# EAGLE design SignBuddy Main Board Schematic (EAGLE 9.6.2)

## Sheet 1 of 3: STM32L0538
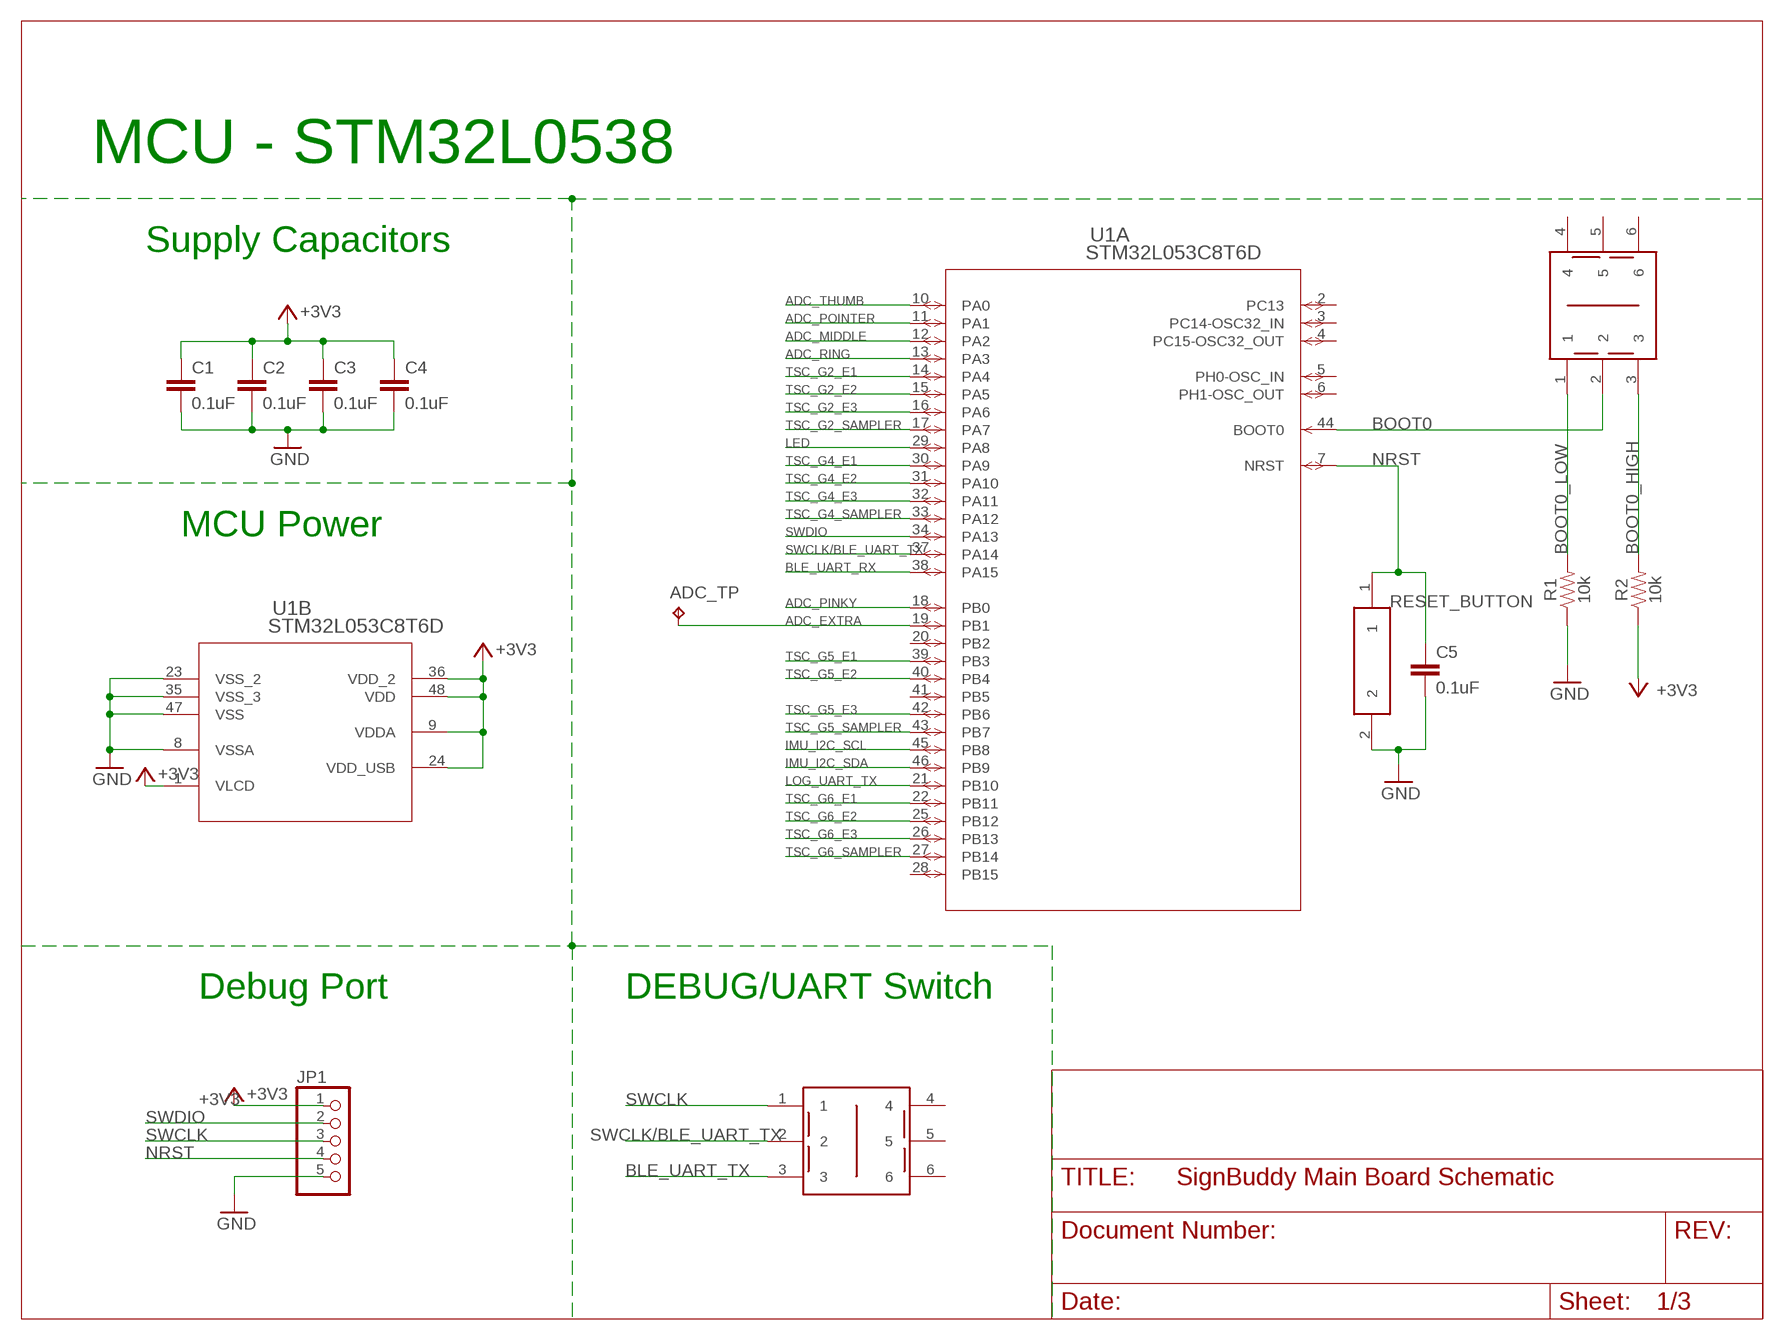
[diagram p0: schematic, sheet 1]

### Parts
ADC_TP  TPB1,27  [B1,27]
C1  0.1uF  10UF-0603-6.3V-20%  [0603]
C2  0.1uF  10UF-0603-6.3V-20%  [0603]
C3  0.1uF  10UF-0603-6.3V-20%  [0603]
C4  0.1uF  10UF-0603-6.3V-20%  [0603]
C5  0.1uF  10UF-0603-6.3V-20%  [0603]
JP1  PINHD-1X5  [1X05]
R1  10k  1.8KOHM-0603-1/10W-1%  [0603]
R2  10k  1.8KOHM-0603-1/10W-1%  [0603]
RESET_BUTTON  PUSH_BUTTON  [PUSH_BUTTON]
U1  STM32L053C8T6D  [LQFP48-7X7MM]
U$1  SLIDE_SWITCH  [SLIDE_SWITCH]
U$2  SLIDE_SWITCH  [SLIDE_SWITCH]

### Nets
+3V3: C1.1 C2.1 C3.1 C4.1 JP1.1 R2.1 U1.1(B:VLCD) U1.9(B:VDDA) U1.24(B:VDD_USB) U1.36(B:VDD_2) U1.48(B:VDD) ; also sheet 2,3
ADC_EXTRA: ADC_TP.TP U1.19(A:PB1)
ADC_MIDDLE: U1.12(A:PA2) ; also sheet 3
ADC_PINKY: U1.18(A:PB0) ; also sheet 3
ADC_POINTER: U1.11(A:PA1) ; also sheet 3
ADC_RING: U1.13(A:PA3) ; also sheet 3
ADC_THUMB: U1.10(A:PA0) ; also sheet 3
BLE_UART_RX: U1.38(A:PA15) ; also sheet 3
BLE_UART_TX: U$2.3 ; also sheet 3
BOOT0: U1.44(A:BOOT0) U$1.2
BOOT0_HIGH: R2.2 U$1.3
BOOT0_LOW: R1.2 U$1.1
GND: C1.2 C2.2 C3.2 C4.2 C5.2 JP1.5 R1.1 RESET_BUTTON.2 U1.8(B:VSSA) U1.23(B:VSS_2) U1.35(B:VSS_3) U1.47(B:VSS) ; also sheet 2,3
IMU_I2C_SCL: U1.45(A:PB8) ; also sheet 3
IMU_I2C_SDA: U1.46(A:PB9) ; also sheet 3
LED: U1.29(A:PA8) ; also sheet 2
LOG_UART_TX: U1.21(A:PB10) ; also sheet 2
NRST: C5.1 JP1.4 RESET_BUTTON.1 U1.7(A:NRST)
SWCLK: JP1.3 U$2.1
SWCLK/BLE_UART_TX: U1.37(A:PA14) U$2.2
SWDIO: JP1.2 U1.34(A:PA13)
TSC_G2_E1: U1.14(A:PA4) ; also sheet 3
TSC_G2_E2: U1.15(A:PA5) ; also sheet 3
TSC_G2_E3: U1.16(A:PA6) ; also sheet 3
TSC_G2_SAMPLER: U1.17(A:PA7) ; also sheet 3
TSC_G4_E1: U1.30(A:PA9) ; also sheet 3
TSC_G4_E2: U1.31(A:PA10) ; also sheet 3
TSC_G4_E3: U1.32(A:PA11) ; also sheet 3
TSC_G4_SAMPLER: U1.33(A:PA12) ; also sheet 3
TSC_G5_E1: U1.39(A:PB3) ; also sheet 3
TSC_G5_E2: U1.40(A:PB4) ; also sheet 3
TSC_G5_E3: U1.42(A:PB6) ; also sheet 3
TSC_G5_SAMPLER: U1.43(A:PB7) ; also sheet 3
TSC_G6_E1: U1.22(A:PB11) ; also sheet 3
TSC_G6_E2: U1.25(A:PB12) ; also sheet 3
TSC_G6_E3: U1.26(A:PB13) ; also sheet 3
TSC_G6_SAMPLER: U1.27(A:PB14) ; also sheet 3
Unconnected: U1.2(A:PC13) U1.3(A:PC14-OSC32_IN) U1.4(A:PC15-OSC32_OUT) U1.5(A:PH0-OSC_IN) U1.6(A:PH1-OSC_OUT) U1.20(A:PB2) U1.28(A:PB15) U1.41(A:PB5) U$1.4 U$1.5 U$1.6 U$2.4 U$2.5 U$2.6

### Notes on the sheet
- MCU - STM32L0538
- Supply Capacitors
- MCU Power
- Debug Port | DEBUG/UART Switch

## Sheet 2 of 3: POWER
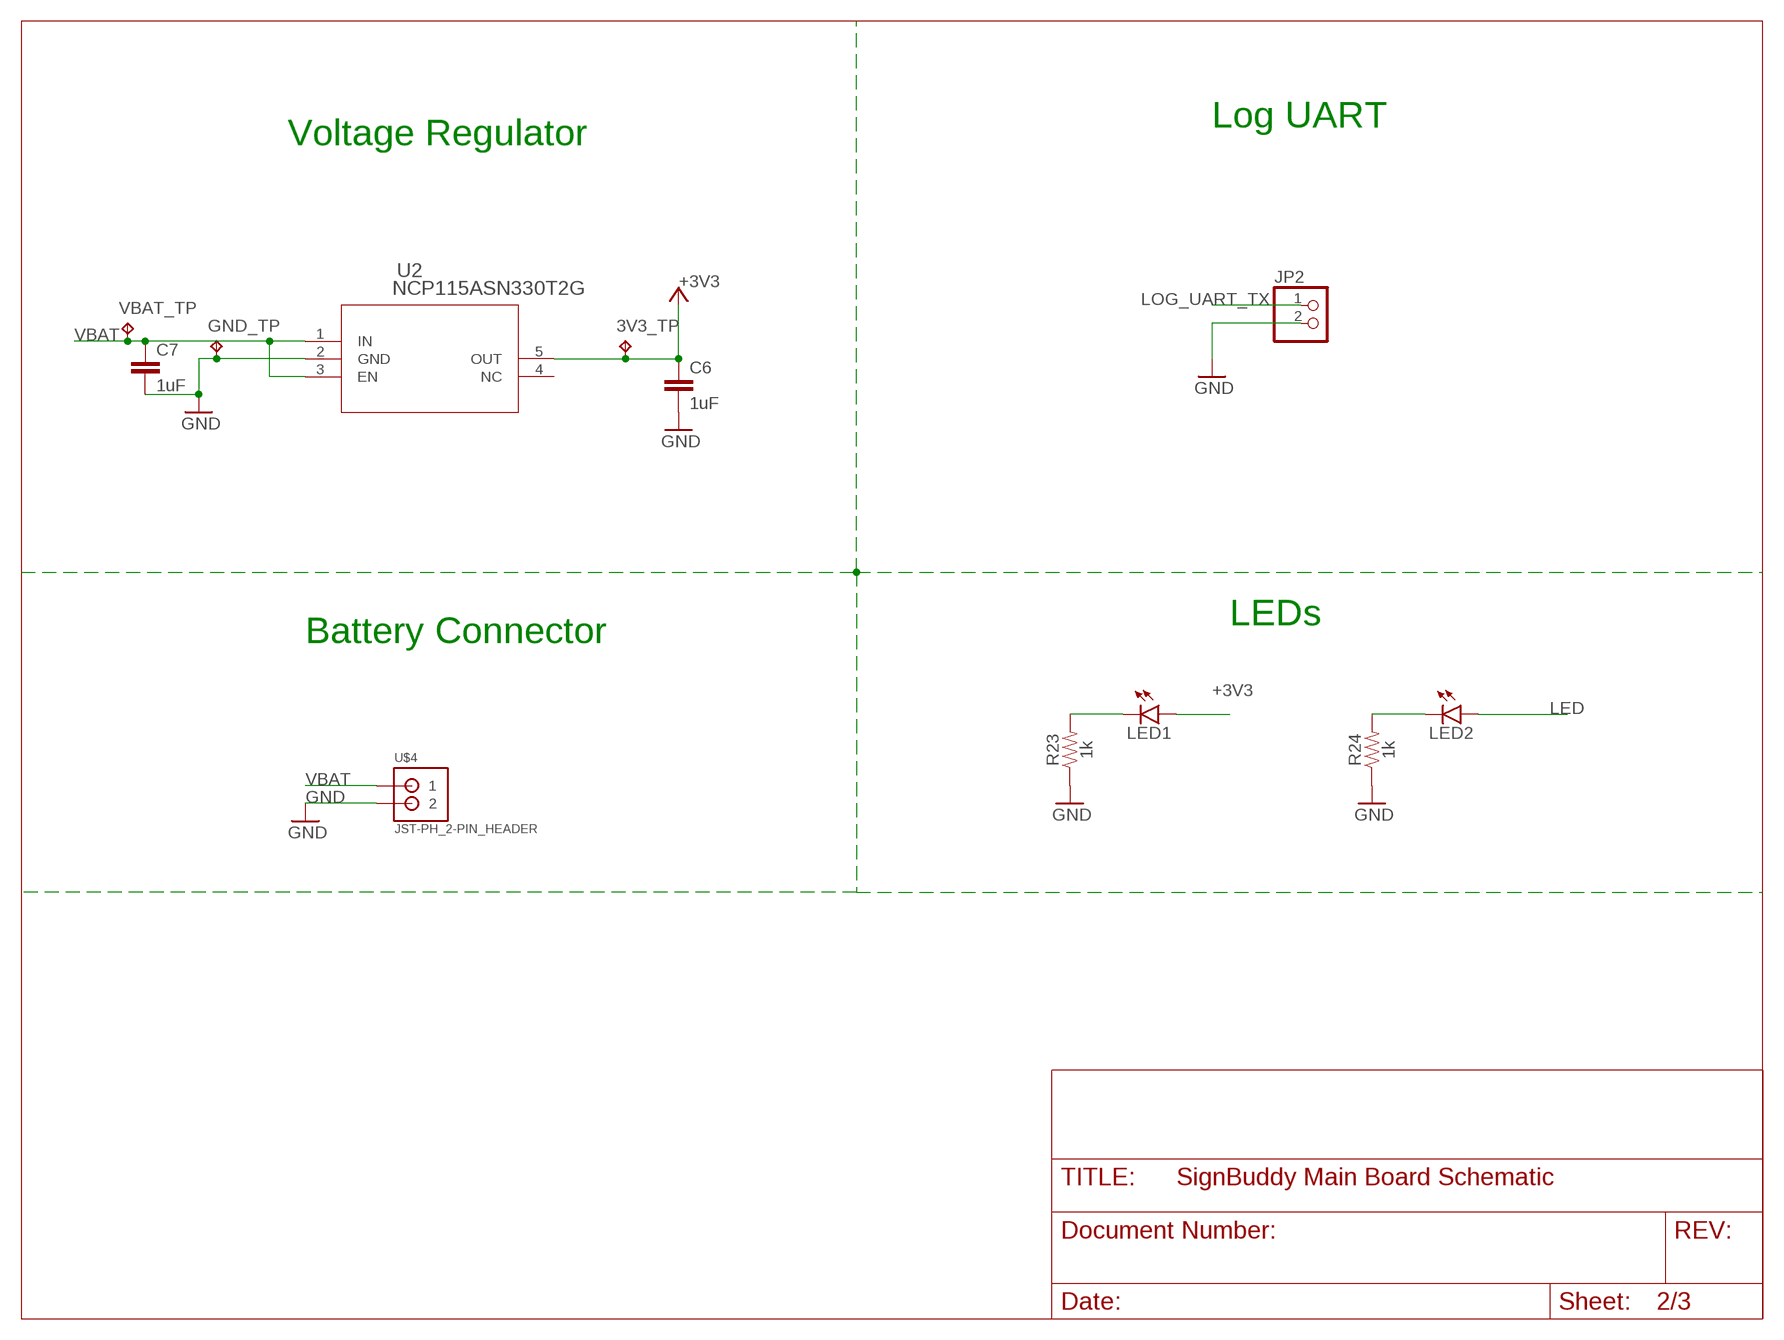
[diagram p1: schematic, sheet 2]

### Parts
3V3_TP  TPB1,27  [B1,27]
C6  1uF  10UF-0603-6.3V-20%  [0603]
C7  1uF  10UF-0603-6.3V-20%  [0603]
GND_TP  TPB1,27  [B1,27]
JP2  PINHD-1X2  [1X02]
LED1  LEDCHIP-LED0603  [CHIP-LED0603]
LED2  LEDCHIP-LED0603  [CHIP-LED0603]
R23  1k  1.5KOHM-0603-1/10W-1%  [0603]
R24  1k  1.5KOHM-0603-1/10W-1%  [0603]
U2  NCP115ASN330T2G  [TSOP-5-483-N_ONS]
U$4  JST-PH_2-PIN_HEADER  [JST_B2B-PH_HEADER]
VBAT_TP  TPB1,27  [B1,27]

### Nets
+3V3: 3V3_TP.TP C6.1 LED1.A U2.5(OUT) ; also sheet 1,3
GND: C6.2 C7.2 GND_TP.TP JP2.2 R23.1 R24.1 U2.2(GND) U$4.P2 ; also sheet 1,3
LED: LED2.A ; also sheet 1
LOG_UART_TX: JP2.1 ; also sheet 1
N$3: LED2.C R24.2
N$17: LED1.C R23.2
VBAT: C7.1 U2.1(IN) U2.3(EN) U$4.P1 VBAT_TP.TP
Unconnected: U2.4(NC)

### Notes on the sheet
- Log UART
- Voltage Regulator
- LEDs
- Battery Connector

## Sheet 3 of 3: External Modules
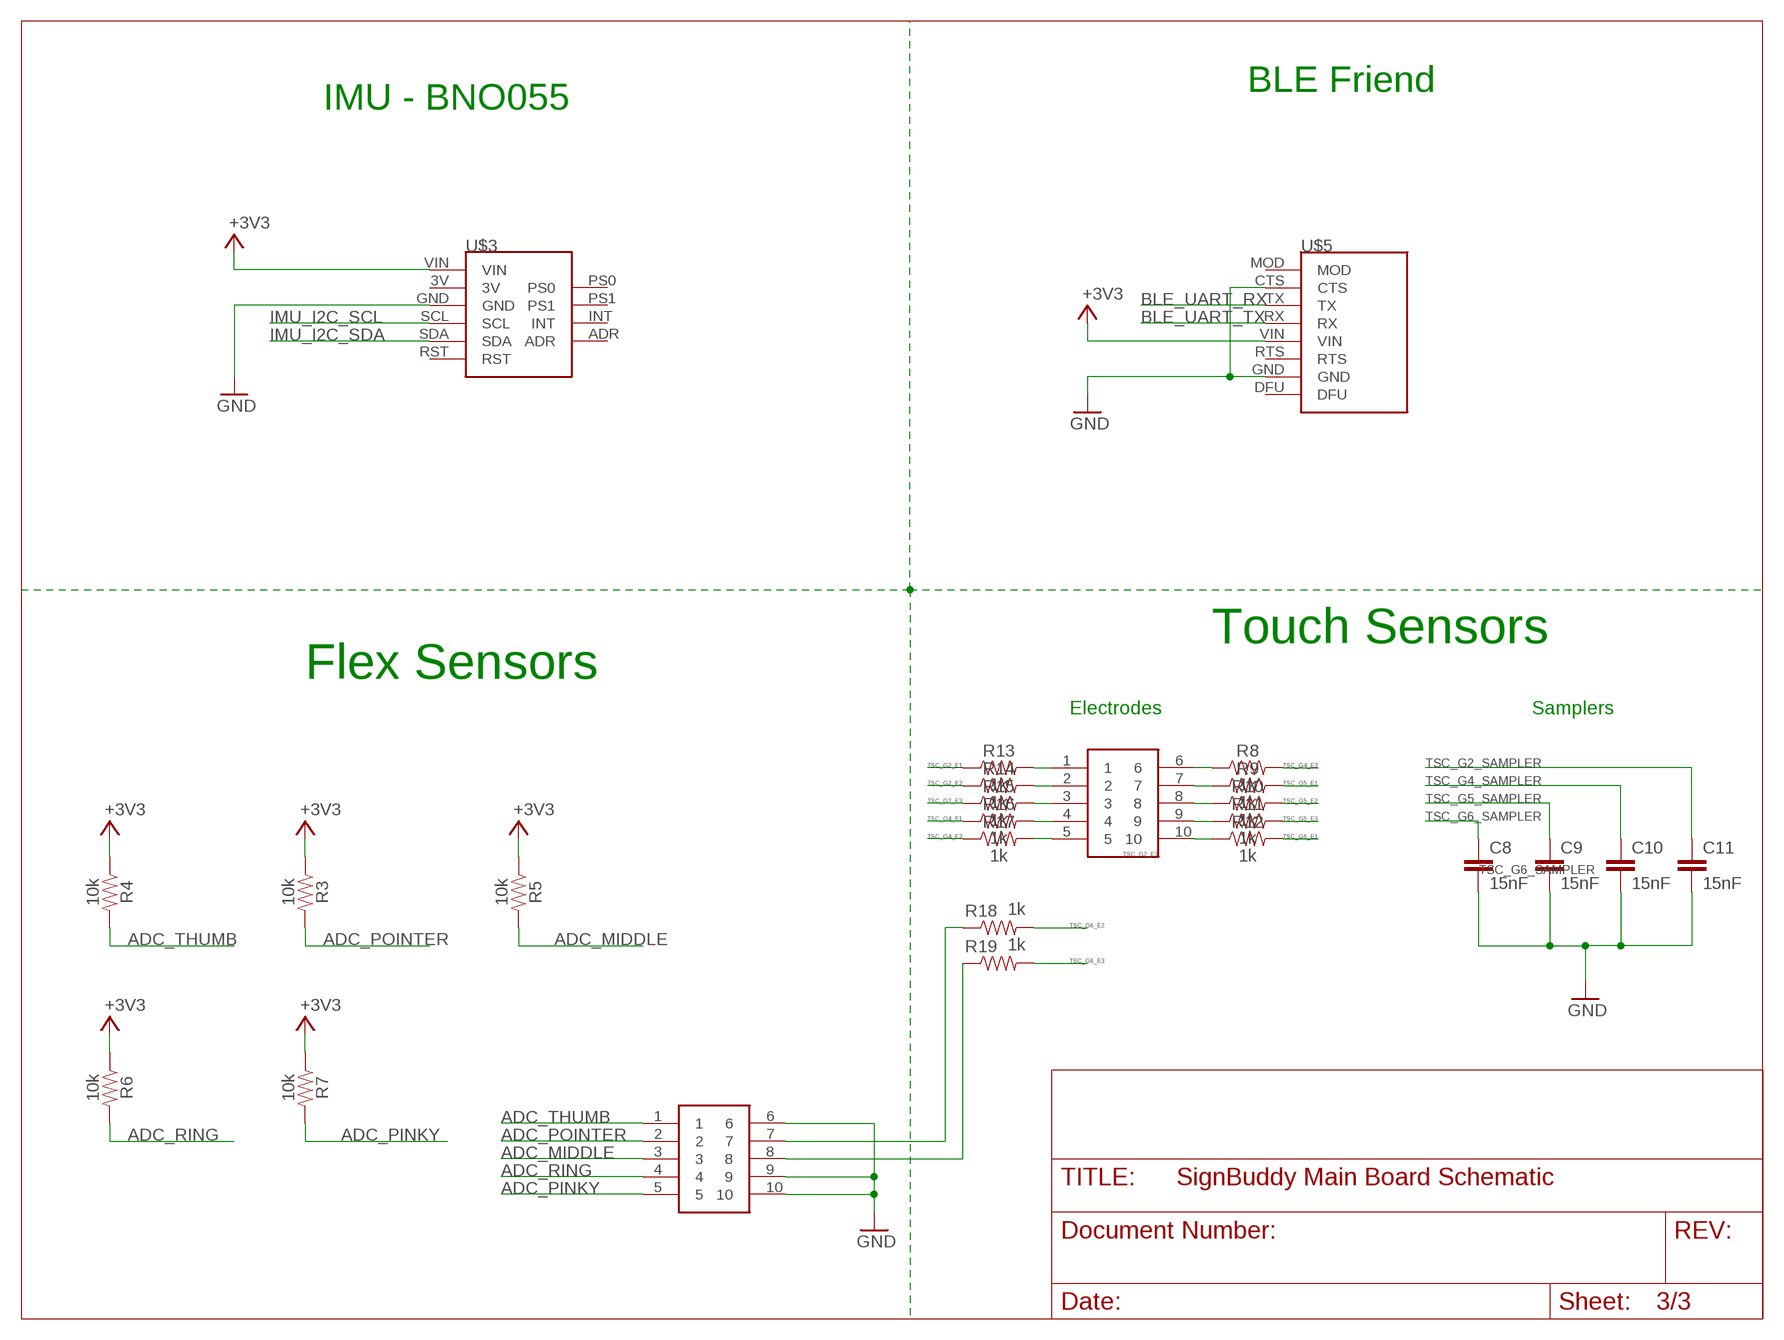
[diagram p2: schematic, sheet 3]

### Parts
C8  15nF  10UF-0603-6.3V-20%  [0603]
C9  15nF  10UF-0603-6.3V-20%  [0603]
C10  15nF  10UF-0603-6.3V-20%  [0603]
C11  15nF  10UF-0603-6.3V-20%  [0603]
R3  10k  10KOHM-0603-1/10W-1%  [0603]
R4  10k  10KOHM-0603-1/10W-1%  [0603]
R5  10k  10KOHM-0603-1/10W-1%  [0603]
R6  10k  10KOHM-0603-1/10W-1%  [0603]
R7  10k  10KOHM-0603-1/10W-1%  [0603]
R8  1k  10KOHM-0603-1/10W-1%  [0603]
R9  1k  10KOHM-0603-1/10W-1%  [0603]
R10  1k  10KOHM-0603-1/10W-1%  [0603]
R11  1k  10KOHM-0603-1/10W-1%  [0603]
R12  1k  10KOHM-0603-1/10W-1%  [0603]
R13  1k  10KOHM-0603-1/10W-1%  [0603]
R14  1k  10KOHM-0603-1/10W-1%  [0603]
R15  1k  10KOHM-0603-1/10W-1%  [0603]
R16  1k  10KOHM-0603-1/10W-1%  [0603]
R17  1k  10KOHM-0603-1/10W-1%  [0603]
R18  1k  10KOHM-0603-1/10W-1%  [0603]
R19  1k  10KOHM-0603-1/10W-1%  [0603]
U$3  BNO055-ADAFRUIT  [BNO055-ADAFRUIT]
U$5  BLE_FRIEND  [BLE_FRIEND]
U$6  10PIN_CONNECTOR  [10PIN_CONNECTOR]
U$7  10PIN_CONNECTOR  [10PIN_CONNECTOR]

### Nets
+3V3: R3.1 R4.1 R5.1 R6.1 R7.1 U$3.VIN U$5.VIN ; also sheet 1,2
ADC_MIDDLE: R5.2 U$7.3 ; also sheet 1
ADC_PINKY: R7.2 U$7.5 ; also sheet 1
ADC_POINTER: R3.2 U$7.2 ; also sheet 1
ADC_RING: R6.2 U$7.4 ; also sheet 1
ADC_THUMB: R4.2 U$7.1 ; also sheet 1
BLE_UART_RX: U$5.TX ; also sheet 1
BLE_UART_TX: U$5.RX ; also sheet 1
GND: C8.2 C9.2 C10.2 C11.2 U$3.GND U$5.CTS U$5.GND U$7.6 U$7.9 U$7.10 ; also sheet 1,2
IMU_I2C_SCL: U$3.SCL ; also sheet 1
IMU_I2C_SDA: U$3.SDA ; also sheet 1
N$5: R13.2 U$6.1
N$6: R18.1 U$7.7
N$7: R19.1 U$7.8
N$8: R14.2 U$6.2
N$9: R15.2 U$6.3
N$10: R16.2 U$6.4
N$11: R17.2 U$6.5
N$12: R8.1 U$6.6
N$13: R9.1 U$6.7
N$14: R10.1 U$6.8
N$15: R11.1 U$6.9
N$16: R12.1 U$6.10
TSC_G2_E1: R13.1 ; also sheet 1
TSC_G2_E2: R14.1 ; also sheet 1
TSC_G2_E3: R15.1 ; also sheet 1
TSC_G2_SAMPLER: C11.1 ; also sheet 1
TSC_G4_E1: R16.1 ; also sheet 1
TSC_G4_E2: R17.1 ; also sheet 1
TSC_G4_E3: R8.2 ; also sheet 1
TSC_G4_SAMPLER: C10.1 ; also sheet 1
TSC_G5_E1: R9.2 ; also sheet 1
TSC_G5_E2: R10.2 ; also sheet 1
TSC_G5_E3: R11.2 ; also sheet 1
TSC_G5_SAMPLER: C9.1 ; also sheet 1
TSC_G6_E1: R12.2 ; also sheet 1
TSC_G6_E2: R18.2 ; also sheet 1
TSC_G6_E3: R19.2 ; also sheet 1
TSC_G6_SAMPLER: C8.1 ; also sheet 1
Unconnected: U$3.3V U$3.ADR U$3.INT U$3.PS0 U$3.PS1 U$3.RST U$5.DFU U$5.MOD U$5.RTS

### Notes on the sheet
- BLE Friend
- IMU - BNO055
- Touch Sensors
- Flex Sensors
- Electrodes | Samplers

## Library data of the parts
3V3_TP ADC_TP GND_TP VBAT_TP = testpad:TP: Test pad
C1-C11 = SparkFun-Capacitors:10UF: 10.0µF ceramic capacitors A capacitor is a passive two-terminal electrical component used to store electrical energy temporarily in an electric field.; PROD_ID: CAP-11015; VALUE: 10uF
JP1 = pinhead:PINHD-1X5: PIN HEADER
JP2 = pinhead:PINHD-1X2: PIN HEADER
LED1 LED2 = led:LED: LED OSRAM: - CHIPLED LG R971, LG N971, LY N971, LG Q971, LY Q971, LO R971, LY R971 LH N974, LH R974 LS Q976, LO Q976, LY Q976 LO Q996 - Hyper CHIPLED LW Q18S LB Q993, LB Q99A, LB R99A - SideLED LS A670, LO A670, LY A670, LG A670, LP A670 LB A673, LV A673, LT A673, LW A673 LH A674 LY A675 LS A676, LA A676, LO A676, LY A676, LW A676 LS A679, LY A679, LG A679 - Hyper Micro SIDELED® LS Y876, LA Y876, LO Y876, LY Y876 LT Y87S - SmartLED LW L88C, LW L88S LB L89C, LB L89S, LG L890 LS L89K, LO L89K, LY L89K LS L896, LA L896, LO L896, LY L896 - TOPLED LS T670, LO T670, LY T670, LG T670, LP T670 LSG T670, LSP T670, LSY T670, LOP T670, LYG T670 LG T671, LOG T671, LSG T671 LB T673, LV T673, LT T673, LW T673 LH T674 LS T676, LA T676, LO T676, LY T676, LB T676, LH T676, LSB T676, LW T676 LB T67C, LV T67C, LT T67C, LS T67K, LO T67K, LY T67K, LW E67C LS E67B, LA E67B, LO E67B, LY E67B, LB E67C, LV E67C, LT E67C LW T67C LS T679, LY T679, LG T679 LS T770, LO T770, LY T770, LG T770, LP T770 LB T773, LV T773, LT T773, LW T773 LH T774 LS E675, LA E675, LY E675, LS T675 LS T776, LA T776, LO T776, LY T776, LB T776 LHGB T686 LT T68C, LB T68C - Hyper Mini TOPLED® LB M676 - Mini TOPLED Santana® LG M470 LS M47K, LO M47K, LY M47K Source: http://www.osram.convergy.de LUXEON: - LUMILED® LXK2-PW12-R00, LXK2-PW12-S00, LXK2-PW14-U00, LXK2-PW14-V00 LXK2-PM12-R00, LXK2-PM12-S00, LXK2-PM14-U00 LXK2-PE12-Q00, LXK2-PE12-R00, LXK2-PE12-S00, LXK2-PE14-T00, LXK2-PE14-U00 LXK2-PB12-K00, LXK2-PB12-L00, LXK2-PB12-M00, LXK2-PB14-N00, LXK2-PB14-P00, LXK2-PB14-Q00 LXK2-PR12-L00, LXK2-PR12-M00, LXK2-PR14-Q00, LXK2-PR14-R00 LXK2-PD12-Q00, LXK2-PD12-R00, LXK2-PD12-S00 LXK2-PH12-R00, LXK2-PH12-S00 LXK2-PL12-P00, LXK2-PL12-Q00, LXK2-PL12-R00 Source: www.luxeon.com KINGBRIGHT: KA-3528ASYC Source: www.kingbright.com
R1 R2 = SparkFun-Resistors:1.8KOHM: 1.8kΩ resistor A resistor is a passive two-terminal electrical component that implements electrical resistance as a circuit element. Resistors act to reduce current flow, and, at the same time, act to lower voltage levels within circuits. - Wikipedia; PROD_ID: RES-09119; VALUE: 1.8k
R3-R7 = SparkFun-Resistors:10KOHM: 10kΩ resistor A resistor is a passive two-terminal electrical component that implements electrical resistance as a circuit element. Resistors act to reduce current flow, and, at the same time, act to lower voltage levels within circuits. - Wikipedia; PROD_ID: RES-00824
R8-R19 = SparkFun-Resistors:10KOHM: 10kΩ resistor A resistor is a passive two-terminal electrical component that implements electrical resistance as a circuit element. Resistors act to reduce current flow, and, at the same time, act to lower voltage levels within circuits. - Wikipedia; PROD_ID: RES-00824; VALUE: 10k
R23 R24 = SparkFun-Resistors:1.5KOHM: 1.5kΩ resistor A resistor is a passive two-terminal electrical component that implements electrical resistance as a circuit element. Resistors act to reduce current flow, and, at the same time, act to lower voltage levels within circuits. - Wikipedia; PROD_ID: RES-08306; VALUE: 1.5k
RESET_BUTTON = PUSH_BUTTON:PUSH_BUTTON
U1 = stm32l053:STM32L053C8T6D; COPYRIGHT: Copyright (C) 2022 Ultra Librarian. All rights reserved.; DIGI-KEY_PART_NUMBER_1: STM32L053C8T6D-ND; MANUFACTURER_PART_NUMBER: STM32L053C8T6D; MFR_NAME: STMicroelectronics
U2 = ncp115:NCP115ASN330T2G; COPYRIGHT: Copyright (C) 2022 Ultra Librarian. All rights reserved.; DIGI-KEY_PART_NUMBER_1: NCP115ASN330T2GOSTR-ND; DIGI-KEY_PART_NUMBER_2: NCP115ASN330T2GOSCT-ND; DIGI-KEY_PART_NUMBER_3: NCP115ASN330T2GOSDKR-ND; DIGI-KEY_PART_NUMBER_4: 2156-NCP115ASN330T2G-OS-ND; MANUFACTURER_PART_NUMBER: NCP115ASN330T2G; MFR_NAME: onsemi
U$1 U$2 = slide_switch:SLIDE_SWITCH
U$3 = bno055-adafruit:BNO055-ADAFRUIT
U$4 = SRG:JST-PH_2-PIN_HEADER: 2-pin JST PH Shrouded Header, top entry P/N B2B-PH-K-S Mating connector PHR-2 Mating cable assembly: Sparkfun PRT-09914 <http://www.sparkfun.com/products/9914>
U$5 = BLE_FRIEND:BLE_FRIEND
U$6 U$7 = 10_PIN_CONNECTOR:10PIN_CONNECTOR

## Board
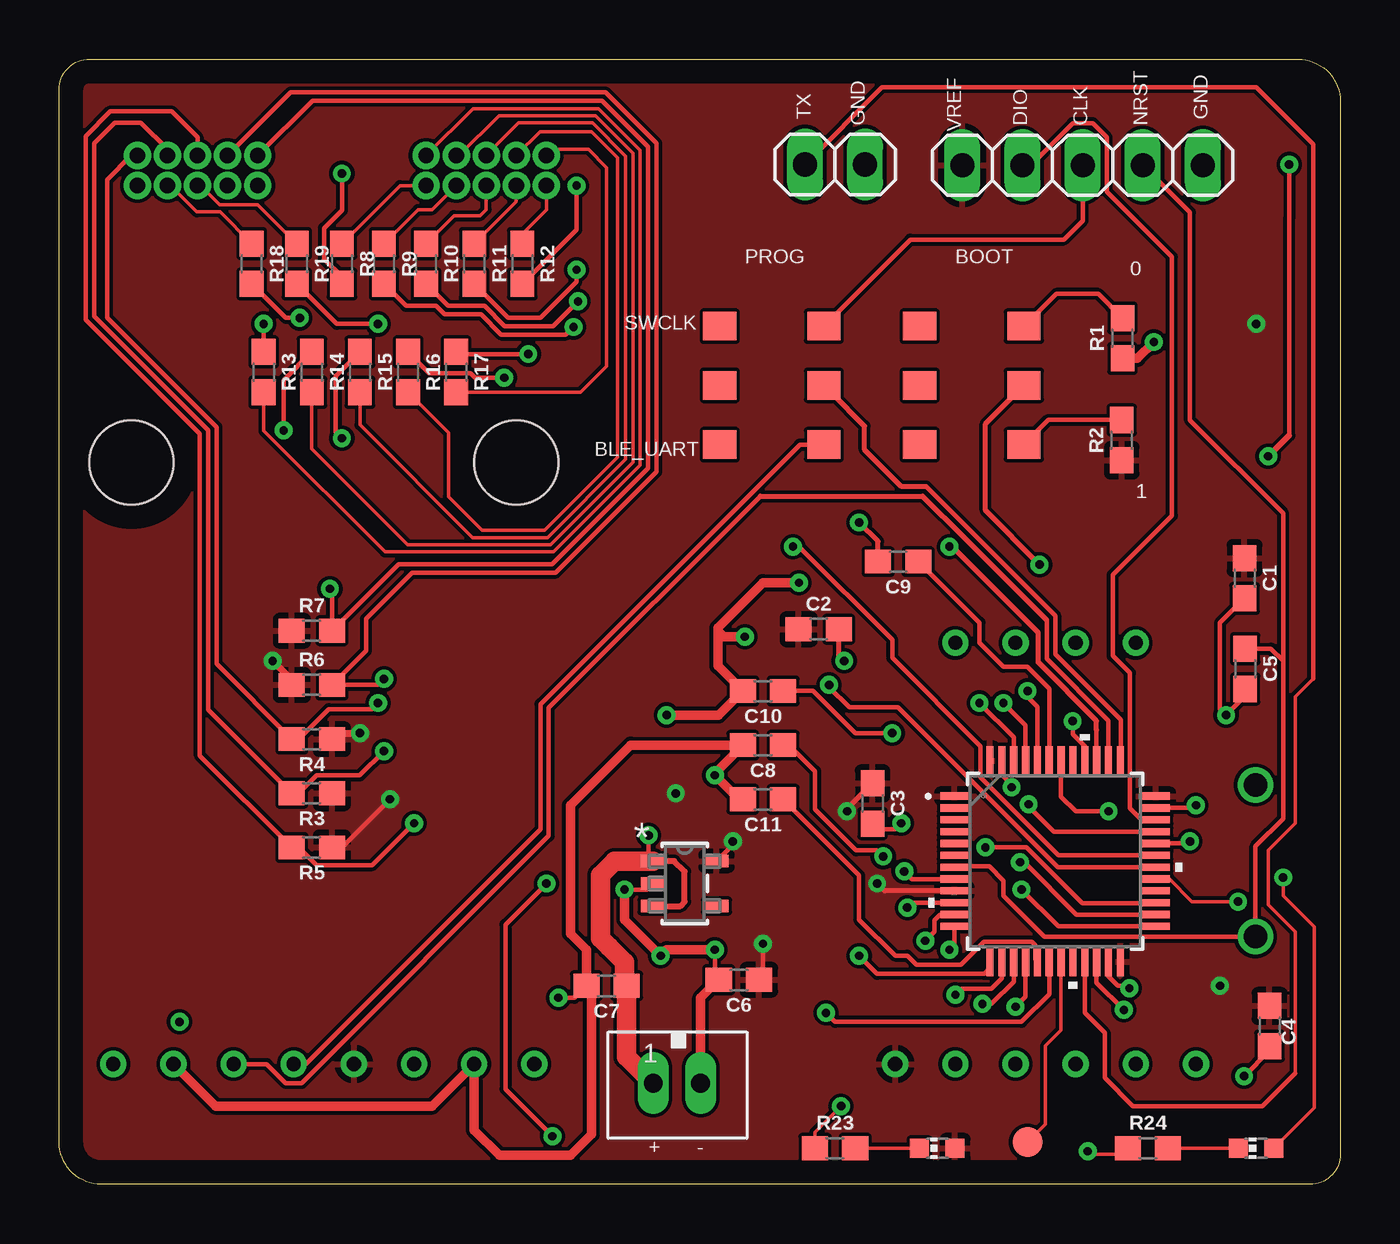
[diagram p3: board, top side]
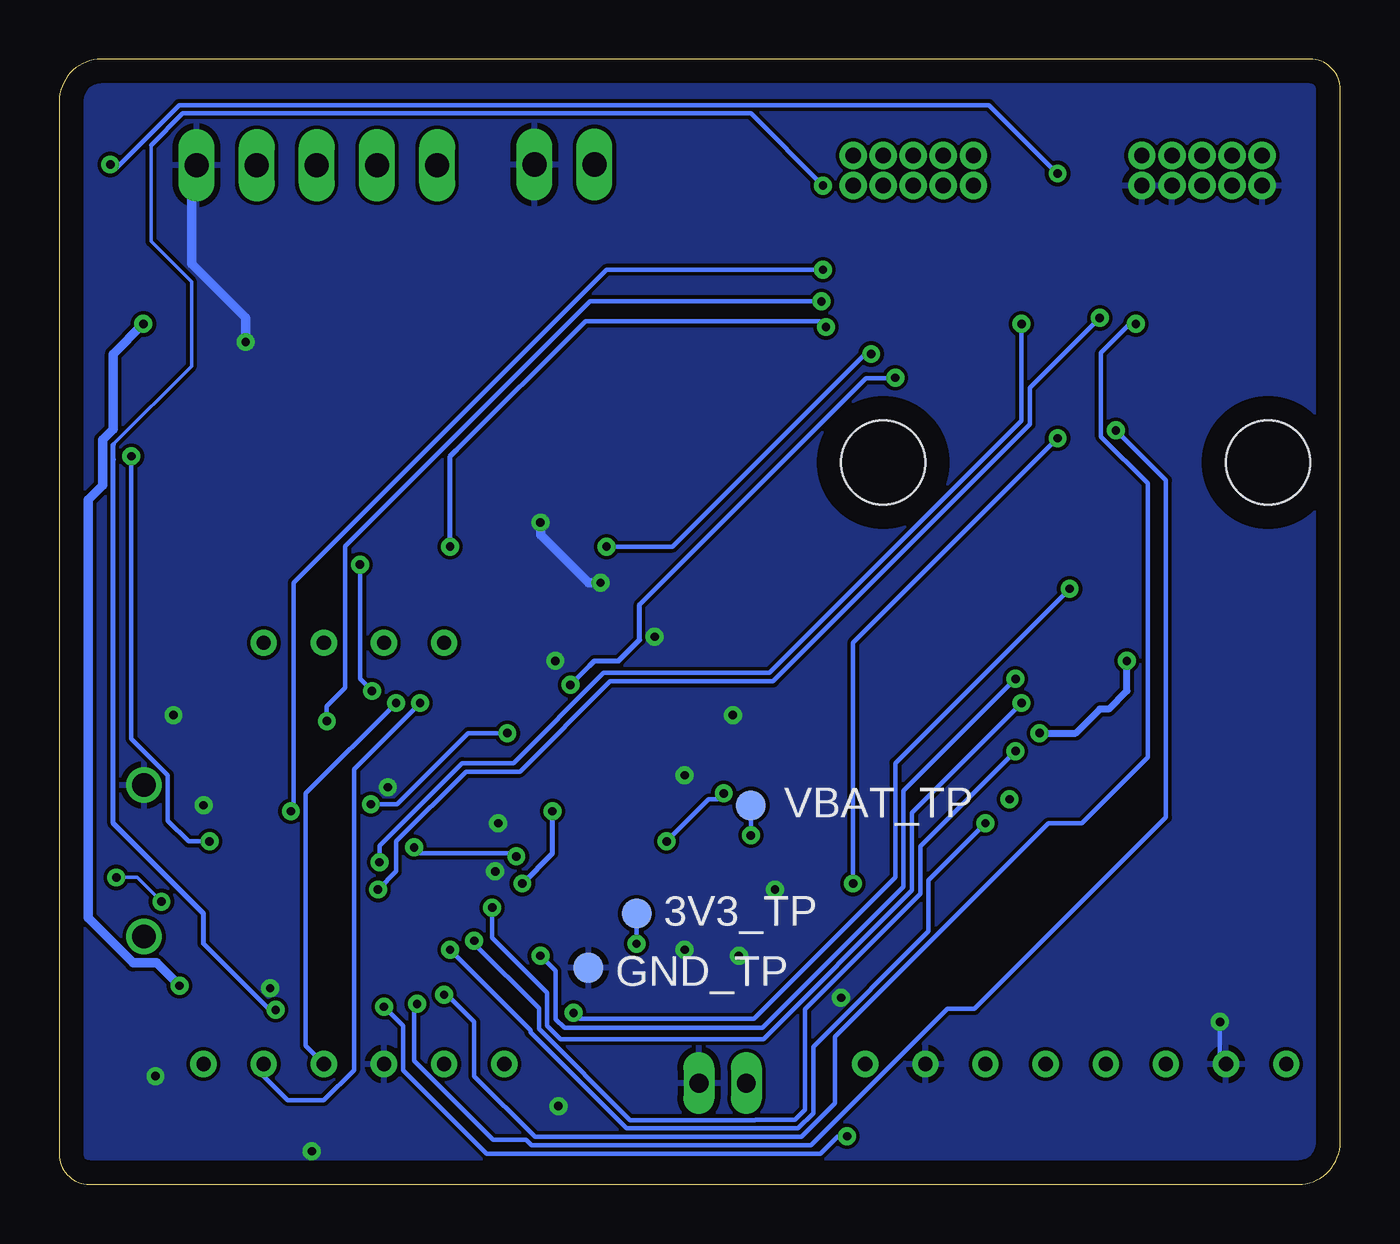
[diagram p4: board, bottom side, seen from below]

Size 54.1 x 47.5 mm. Coordinates in mm from the lower left corner, seen from the top.
Outline: 0,46.23 arc-90 1.27,47.5 52.32,47.5 arc-90 54.1,45.72 54.1,1.27 arc-90 52.83,0 1.78,0 arc-90 0,1.78 0,46.23
Copper layers (1*16): Top 0.035mm / dielectric 1.5mm / Bottom 0.035mm
Design rules "default": minimum track width 6mil, minimum drill 0.35mm, track to track 6mil, track to pad 6mil, pad to pad 6mil, via to via 6mil, smd to smd 6mil, copper to edge 40mil, drill to drill 6mil, minimum pad ring 10mil, minimum via ring 8mil, stop-mask expansion 4mil, vias tented up to drill 0mil, thermal gap 10mil

### Footprints (pad centres in the part's own frame; a part is rotated, then mirrored left to right if it is on the bottom)
B1,27 = smd 1.27 x 1.27: TP 0,0
0603 = smd 1.1 x 1: 1 -0.85,0; 2 0.85,0
1X05 = drill 1.016 long: 1 -5.08,0; 2 -2.54,0; 3 0,0; 4 2.54,0; 5 5.08,0
1X02 = drill 1.016 long: 1 -1.27,0; 2 1.27,0
CHIP-LED0603 = smd 0.8 x 0.8: A 0,-0.75; C 0,0.75
PUSH_BUTTON = drill 1: 1 0,0; 2 6.4,0
LQFP48-7X7MM = smd 1.194 x 0.305: 1 -4.25,2.75; 2 -4.25,2.25; 3 -4.25,1.75; 4 -4.25,1.25; 5 -4.25,0.75; 6 -4.25,0.25; 7 -4.25,-0.25; 8 -4.25,-0.75; 9 -4.25,-1.25; 10 -4.25,-1.75; 11 -4.25,-2.25; 12 -4.25,-2.75; 25 4.25,-2.75; 26 4.25,-2.25; 27 4.25,-1.75; 28 4.25,-1.25; 29 4.25,-0.75; 30 4.25,-0.25; 31 4.25,0.25; 32 4.25,0.75; 33 4.25,1.25; 34 4.25,1.75; 35 4.25,2.25; 36 4.25,2.75 | smd 0.305 x 1.194: 13 -2.75,-4.25; 14 -2.25,-4.25; 15 -1.75,-4.25; 16 -1.25,-4.25; 17 -0.75,-4.25; 18 -0.25,-4.25; 19 0.25,-4.25; 20 0.75,-4.25; 21 1.25,-4.25; 22 1.75,-4.25; 23 2.25,-4.25; 24 2.75,-4.25; 37 2.75,4.25; 38 2.25,4.25; 39 1.75,4.25; 40 1.25,4.25; 41 0.75,4.25; 42 0.25,4.25; 43 -0.25,4.25; 44 -0.75,4.25; 45 -1.25,4.25; 46 -1.75,4.25; 47 -2.25,4.25; 48 -2.75,4.25
TSOP-5-483-N_ONS = smd 1.029 x 0.508: 1 -1.34,0.95; 2 -1.34,0; 3 -1.34,-0.95; 4 1.34,-0.95; 5 1.34,0.95
SLIDE_SWITCH = smd 1.2 x 1.4: 1 -2.5,2.5; 2 0,2.5; 3 2.5,2.5; 4 -2.5,-1.9; 5 0,-1.9; 6 2.5,-1.9
BNO055-ADAFRUIT = drill 0.6: 3V -2.54,-10.16; ADR 5.08,7.62; GND 0,-10.16; INT 2.54,7.62; PS0 -2.54,7.62; PS1 0,7.62; RST 7.62,-10.16; SCL 2.54,-10.16; SDA 5.08,-10.16; VIN -5.08,-10.16
JST_B2B-PH_HEADER = drill 0.8 long: P1 1.075,0.048; P2 -0.925,0.048
BLE_FRIEND = drill 0.6: CTS -7.62,0; DFU 7.62,0; GND 5.08,0; MOD -10.16,0; RTS 2.54,0; RX -2.54,0; TX -5.08,0; VIN 0,0 | hole 3.556: 6.858,25.4; -9.398,25.4
10PIN_CONNECTOR = drill 0.65 pad 0.9: 1 -2.54,0; 2 -1.27,0; 3 0,0; 4 1.27,0; 5 2.54,0; 6 -2.54,-1.27; 7 -1.27,-1.27; 8 0,-1.27; 9 1.27,-1.27; 10 2.54,-1.27

### Placement (x,y rotation side)
3V3_TP  29.72,11.43 0 bottom
ADC_TP  40.89,1.78 0 top
C1  50.06,25.58 270 top
C2  32.07,23.44 0 top
C3  34.35,16.08 270 top
C4  51.11,6.68 270 top
C5  50.08,21.76 270 top
C6  28.7,8.64 180 top
C7  23.11,8.38 180 top
C8  29.72,18.54 180 top
C9  35.43,26.29 180 top
C10  29.72,20.83 180 top
C11  29.72,16.26 180 top
GND_TP  31.75,9.14 0 bottom
JP1  43.22,43.02 0 top
JP2  32.77,43.05 0 top
LED1  37.08,1.52 90 top
LED2  50.55,1.52 90 top
R1  44.9,35.72 90 top
R2  44.87,31.42 90 top
R3  10.67,16.51 180 top
R4  10.67,18.8 180 top
R5  10.67,14.22 180 top
R6  10.67,21.08 0 top
R7  10.67,23.37 0 top
R8  11.94,38.86 270 top
R9  13.72,38.86 270 top
R10  15.49,38.86 270 top
R11  17.53,38.86 270 top
R12  19.56,38.86 270 top
R13  8.64,34.29 270 top
R14  10.67,34.29 270 top
R15  12.7,34.29 270 top
R16  14.73,34.29 270 top
R17  16.76,34.29 270 top
R18  8.13,38.86 270 top
R19  10.03,38.86 270 top
R23  32.77,1.52 0 top
R24  45.97,1.52 0 top
RESET_BUTTON  50.52,10.46 90 top
U1  42.06,13.64 0 top
U2  26.42,12.7 0 top
U$1  38.24,33.73 270 top
U$2  29.79,33.73 270 top
U$3  40.39,15.24 0 top
U$4  26.16,4.32 180 top
U$5  12.45,5.08 0 top
U$6  18.03,43.43 0 top
U$7  5.84,43.43 0 top
VBAT_TP  24.89,16 0 bottom

### Tracks (layer width: path | path; a pad name or v marks a point on that pad's centre or on a via)
+3V3  (via drill 0.35)
  Top 0.2: v29.72,10.16 29.72,8.8 C6.1 | R5.1 11.94,14.22 v13.97,16.26 | U2.5 28.45,14.34 v28.45,14.48
  Top 0.203: U1.9 34.85,12.39 v34.54,12.7 | v33.27,15.75 33.27,15.85 C3.1
  Top 0.305: R4.1 11.77,19.05 v12.7,19.05 | R6.1 9.82,21.29 v9.01,22.1
  Bottom 0.2: 3V3_TP.TP v29.72,10.16 | v26.04,16.5 26.29,16.25 26.68,16.25 v28.45,14.48
  Bottom 0.203: v34.54,12.7 33.27,13.97 v33.27,15.75
  Bottom 0.305: v12.7,19.05 11.18,19.05 10.16,20.07 9.78,20.07 9.01,20.83 v9.01,22.1
  Bottom 0.406: v49.02,8.38 49.99,9.35 50.98,9.35 52.88,11.25 52.88,28.9 52.27,29.52 52.27,31.43 51.82,31.88 51.82,35.05 v50.55,36.32
  pour Top: -1.78,48.01 -1.78,2.03 1.02,-0.76 54.86,-0.76 56.64,1.02 56.64,46.48 54.1,49.02 -0.76,49.02
ADC_EXTRA
  Top 0.152: U1.19 42.31,6.5 41.66,5.84 41.66,2.54 ADC_TP.TP
ADC_MIDDLE  (via drill 0.35)
  Top 0.2: U$7.3 5.84,44.2 4.75,45.29 2.16,45.29 1.12,44.25 1.12,36.51 5.94,31.68 5.94,18.1 R5.2 10.11,14.22 10.86,13.47 13.22,13.47 v14.99,15.24 | v37.59,9.9 37.81,10.12 U1.12
  Bottom 0.2: v14.99,15.24 17.39,12.84 17.39,10.68 22.25,5.81 22.25,3 22.9,2.36 30.14,2.36 34.2,6.41 34.2,6.51 v37.59,9.9
ADC_PINKY  (via drill 0.35)
  Top 0.2: U$7.5 10.69,45.75 22.92,45.75 24.86,43.8 24.86,30.22 20.81,26.18 14.33,26.18 R7.2 11.52,25.06 v11.43,25.15 | U1.18 41.81,8.03 40.64,6.86 32.77,6.86 v32.39,7.24
  Bottom 0.2: v11.43,25.15 18.8,17.78 18.8,12.95 24.76,6.99 32.13,6.99 v32.39,7.24
ADC_POINTER  (via drill 0.35)
  Top 0.2: U$7.2 4.57,43.69 3.43,44.83 2.35,44.83 1.47,43.94 1.47,36.65 6.29,31.82 6.29,20.03 R3.2 10.11,16.51 10.86,17.26 12.69,17.26 v13.72,18.29 | v36.58,10.28 36.96,10.67 36.96,11.15 37.2,11.39 U1.11
  Bottom 0.2: v13.72,18.29 17.74,14.27 17.74,12.26 22.61,7.39 22.61,3.15 22.78,2.97 22.86,2.89 23.04,2.72 24.7,2.72 24.71,2.71 30,2.71 33.85,6.56 33.85,7.43 36.58,10.16 v36.58,10.28
ADC_RING  (via drill 0.35)
  Top 0.2: U$7.4 9.78,46.1 23.06,46.1 25.22,43.95 25.22,30.08 20.96,25.82 14.9,25.82 12.95,23.88 12.95,22.52 R6.2 13.46,21.08 v13.72,21.34 | U1.13 39.31,9.14 39.06,8.89 34.54,8.89 v33.78,9.65
  Bottom 0.2: v13.72,21.34 18.44,16.61 18.44,12.55 24.39,6.6 32.77,6.6 33.14,6.98 33.14,9.01 v33.78,9.65
ADC_THUMB  (via drill 0.35)
  Top 0.2: U$7.1 3.05,43.43 2.03,42.42 2.03,36.59 6.65,31.97 6.65,21.97 R4.2 10.11,18.8 11.38,20.07 13.21,20.07 v13.46,20.32 | v35.81,11.68 36.02,11.89 U1.10
  Bottom 0.2: v13.46,20.32 18.09,15.69 18.09,12.41 24.37,6.13 32.92,6.13 33.5,6.71 33.5,8.09 35.81,10.41 v35.81,11.68
BLE_UART_RX
  Top 0.2: U1.38 44.31,19.57 41.7,22.18 41.7,23.82 | 29.61,29.06 20.67,20.11 20.67,14.71 10.24,4.27 9.57,4.27 8.77,5.08 U$5.TX
  Top 0.203: 29.61,29.06 36.46,29.06 38.24,27.28 41.7,23.82
BLE_UART_TX
  Top 0.2: U$2.3 31.28,31.23 20.32,20.27 20.32,14.99 10.41,5.08 U$5.RX
BOOT0  (via drill 0.35)
  Top 0.2: U1.44 41.31,20.16 40.89,20.57 v40.89,20.83
  Top 0.203: v41.4,26.16 39.12,28.45 39.12,32.11 U$1.2
  Bottom 0.2: v41.4,26.16 41.4,21.34 v40.89,20.83
BOOT0_HIGH
  Top 0.2: U$1.3 41.78,32.27 R2.2
BOOT0_LOW
  Top 0.2: R1.2 43.88,37.59 42.1,37.59 U$1.1
GND  (via drill 0.35)
  Top 0.152: R23.1 31.92,2.2 v33.02,3.3 | R24.1 44.87,1.27 43.43,1.27 v43.43,1.39
  Top 0.2: U2.2 24.82,12.45 v23.88,12.45 | C7.2 21.76,7.87 v21.08,7.87 | C6.2 27.69,8.8 v27.69,9.91 | U1.35 47.89,15.89 v48.01,16 | C1.2 49.02,23.7 49.02,20.07 v49.28,19.81 50.08,20.62 C5.2 | v35.69,13.21 36.01,12.89 U1.8 | C3.2 34.59,14.99 35.31,14.99 v35.56,15.24 | v40.22,16.76 40.22,16.87 39.81,17.28 U1.47 | v50.04,4.57 51.11,5.65 C4.2 | U1.23 44.28,9.36 44.28,8.82 44.71,8.38 45.09,8.38 v45.19,8.28
  Top 0.203: C9.2 34.58,27.14 v33.78,27.94 | v33.15,22.1 32.92,22.32 C2.2
  Top 0.406: v31.24,25.4 29.72,25.4 27.81,23.49 27.81,23.37 | 27.81,23.37 27.81,21.88 C10.2 27.85,19.81 v25.65,19.81 | v28.96,23.11 28.07,23.11 27.81,23.37 | v23.88,12.45 23.88,11.18 v25.4,9.65 25.65,9.91 v27.69,9.91 | U$4.P2 27.09,7.87 C6.2 | C7.2 22.26,8.64 | 22.26,8.64 22.26,9.91 21.59,10.58 21.59,16 24.13,18.54 C8.2 27.69,17.36 v27.69,17.27 28.7,16.26 C11.2 | 22.26,8.64 22.48,8.42 22.48,2.11 21.59,1.22 18.59,1.22 17.53,2.29 U$5.GND 15.75,3.3 6.6,3.3 U$5.CTS | R1.1 45.54,34.87 v46.23,35.56
  Bottom 0.2: v5.08,6.86 5.08,5.33 U$5.CTS
  Bottom 0.406: v33.78,27.94 33.78,27.43 31.75,25.4 v31.24,25.4 | v46.23,35.56 46.23,36.58 48.51,38.86 48.51,42.81 JP1.5
  pour Bottom: -1.52,49.78 -3.3,48.01 -3.3,45.72 -3.3,1.02 -0.25,-2.03 55.37,-2.03 59.18,1.78 59.18,46.74 55.12,50.8 -0.51,50.8
IMU_I2C_SCL  (via drill 0.35)
  Top 0.2: U1.45 40.81,19.39 v39.88,20.32
  Bottom 0.2: v39.88,20.32 43.69,16.51 43.69,5.84 U$3.SCL
IMU_I2C_SDA  (via drill 0.35)
  Top 0.2: U1.46 40.31,18.87 v38.86,20.32
  Bottom 0.2: v38.86,20.32 41.66,17.53 41.66,4.83 42.93,3.56 44.45,3.56 45.47,4.57 U$3.SDA
LED  (via drill 0.35)
  Top 0.152: 51.56,1.79 LED2.A 53.01,3.24 53.01,10.87 51.69,12.19 v51.69,12.95 | U1.29 46.32,12.9 46.88,12.9 47.84,11.94 v49.78,11.94
  Bottom 0.152: v51.69,12.95 50.8,12.95 v49.78,11.94
LOG_UART_TX
  Top 0.152: 52.2,4.7 52.2,10.67 51.05,11.81 51.05,14.1 52.2,15.24 52.2,20.58 52.95,21.34
  Top 0.2: JP2.1 34.75,46.31 50.55,46.31 52.95,43.9 52.95,21.34 | U1.21 43.31,7.24 44.15,6.39 44.15,4.49 45.34,3.3 50.8,3.3 52.2,4.7
N$3
  Top 0.152: LED2.C R24.2
N$5
  Top 0.152: R13.2 8.64,31.81 13.75,26.7 20.87,26.7 24.54,30.36 24.54,43.66 22.78,45.42 17.48,45.42 U$6.1
N$6
  Top 0.152: R18.1 6.79,41.05 5.81,41.05 4.7,42.16 U$7.7
N$7
  Top 0.152: R19.1 8.39,41.36 6.78,41.36 5.97,42.16 U$7.8
N$8
  Top 0.152: R14.2 10.67,31.05 14.72,27 20.74,27 24.23,30.49 24.23,43.54 22.65,45.11 18.57,45.11 16.89,43.43 U$6.2
N$9
  Top 0.152: R15.2 12.7,32.07 17.46,27.3 20.62,27.3 23.93,30.61 23.93,43.41 22.53,44.81 19.41,44.81 U$6.3
N$10
  Top 0.152: R16.2 16.43,31.74 16.43,29.04 17.86,27.61 20.49,27.61 23.57,30.69 23.57,43.34 22.48,44.43 20.3,44.43 U$6.4
N$11
  Top 0.152: R17.2 22.01,33.44 23.11,34.54 23.11,42.93 22.35,43.69 20.83,43.69 U$6.5
N$12
  Top 0.152: R8.1 14.39,42.16 U$6.6
N$13
  Top 0.152: R9.1 15.15,41.15 15.75,41.15 U$6.7
N$14
  Top 0.152: R10.1 16.68,40.89 17.78,40.89 18.03,41.15 U$6.8
N$15
  Top 0.152: R11.1 19.3,41.49 U$6.9
N$16
  Top 0.152: R12.1 19.56,40.13 20.57,41.15 U$6.10
N$17
  Top 0.152: LED1.C R23.2
NRST
  Top 0.2: 51.68,22.1 51.68,15.43 50.52,14.27 RESET_BUTTON.1 41.61,10.46 39.88,12.19 39.88,12.82 39.27,13.42 37.84,13.42 U1.7 | 51.68,22.1 51.68,28.33 47.75,32.26 47.75,41.03 JP1.4 | C5.1 51.17,22.61 51.68,22.1
SWCLK
  Top 0.2: U$2.1 35.94,39.88 42.42,39.88 43.22,40.68 JP1.3
SWCLK/BLE_UART_TX
  Top 0.2: 36.62,29.45 42.06,24.01 42.06,22.39 44.84,19.61 44.84,17.92 U1.37 | 32.63,33.39 U$2.2
  Top 0.203: 36.62,29.45 35.57,29.45 34.01,31.02 34.01,32.01 32.63,33.39
SWDIO
  Top 0.2: U1.34 46.28,15.36 45.74,15.36 45.22,15.88 45.22,21.59 44.49,22.31 44.49,25.73 46.99,28.23 46.99,39.16 44.24,41.91 44.24,44.2 43.64,44.8 42.8,44.8 41.03,43.02 JP1.2
TSC_G2_E1  (via drill 0.35)
  Top 0.2: U1.14 39.81,8.7 39.37,8.25 38.1,8.25 v37.85,8 | v8.64,36.32 R13.1
  Bottom 0.2: v37.85,8 37.72,8 36.58,6.86 36.58,4.57 34.01,2 22.75,2 21.34,3.42 21.34,6.23 12.33,15.24 10.92,15.24 8.13,18.03 8.13,29.59 10.11,31.57 10.11,35.1 8.89,36.32 v8.64,36.32
TSC_G2_E2  (via drill 0.35)
  Top 0.2: U1.15 40.31,8.56 39.37,7.62 v38.99,7.62 | v9.48,31.83 9.48,33.95 R14.1
  Bottom 0.2: v38.99,7.62 39.12,7.49 39.12,5.21 35.78,1.88 34.38,1.88 34.16,1.65 22.35,1.65 16.59,7.41 15.45,7.41 7.37,15.49 7.37,29.72 v9.48,31.83
TSC_G2_E3  (via drill 0.35)
  Top 0.2: U1.16 40.81,7.92 v40.39,7.5 | v20.83,2.03 18.84,4.02 18.84,10.97 v20.57,12.7 | R15.1 11.68,34.12 11.68,31.75 v11.94,31.5
  Bottom 0.2: v40.39,7.5 39.58,6.69 39.58,4.83 36.05,1.3 21.95,1.3 21.22,2.03 v20.83,2.03 | v11.94,31.5 20.57,22.86 v20.57,12.7
TSC_G2_SAMPLER
  Top 0.2: U1.17 41.22,9.48 41.22,10.09 41.07,10.24 39.05,10.24 38.09,9.27 36.2,9.27 35.81,9.65 35.31,9.65 33.78,11.18 33.78,13.04 C11.1
TSC_G4_E1  (via drill 0.35)
  Top 0.2: U1.30 42.17,13.39 35.42,20.14 33.36,20.14 32.51,20.99 v32.51,21.08 | v18.8,34.05 17.56,34.05 17.37,34.24 15.63,34.24 R16.1
  Bottom 0.2: v32.51,21.08 31.71,21.89 | 29.57,24.49 20.03,34.04 18.81,34.04 v18.8,34.05
  Bottom 0.203: 31.71,21.89 31.5,22.1 30.48,22.1 29.59,22.99 29.59,24.48 29.57,24.49
TSC_G4_E2  (via drill 0.35)
  Top 0.2: U1.31 42.2,13.89 38.91,17.19 38.91,18.5 35.18,22.22 35.18,22.99 31.24,26.92 v30.99,26.92 | v19.81,35.05 16.85,35.05 R17.1
  Bottom 0.2: v30.99,26.92 28.19,26.92 20.07,35.05 v19.81,35.05
TSC_G4_E3  (via drill 0.35)
  Top 0.2: R8.2 11.94,38.3 11.19,39.06 11.19,40.37 11.94,41.12 v11.94,42.67 | v51.94,43.05 51.94,40.77 | 51.94,40.77 | 51.94,31.62 51.94,40.77 | v47.75,14.48 47.66,14.39 U1.32
  Top 0.254: v51.05,30.73 51.94,31.62
  Bottom 0.2: v11.94,42.67 14.83,45.56 49.04,45.56 51.67,42.93 51.82,42.93 v51.94,43.05 | v51.05,30.73 51.05,18.81 49.51,17.27 49.51,15.35 48.64,14.48 v47.75,14.48
TSC_G4_SAMPLER  (via drill 0.35)
  Top 0.2: U1.33 42.01,14.89 40.89,16 v40.94,16.05 | v35.18,19.05 33.62,19.05 31.84,20.83 C10.1
  Bottom 0.2: v40.94,16.05 39.83,16.05 36.83,19.05 v35.18,19.05
TSC_G5_E1  (via drill 0.35)
  Top 0.2: R9.2 14.64,37.08 15.92,37.08 16.28,36.73 17.81,36.73 18.67,35.87 21.39,35.87 v21.71,36.19 v21.72,36.19 | U1.39 43.81,19.18
  Top 0.203: v37.59,26.92 37.72,26.92 41.35,23.3 41.35,22.03 43.81,19.57 43.81,19.18
  Bottom 0.2: v21.72,36.19 21.97,36.45 31.88,36.45 37.34,30.99
  Bottom 0.203: v37.59,26.92 37.59,30.73 37.34,30.99
TSC_G5_E2  (via drill 0.35)
  Top 0.2: R10.2 16.42,37.08 17.96,37.08 18.82,36.22 20.86,36.22 v21.91,37.27 | U1.40 43.34,17.92 43.34,18.46 42.8,19.01 v42.8,19.56
  Bottom 0.2: v21.91,37.27 31.69,37.27 42.03,26.93 42.03,20.96 42.8,20.19 v42.8,19.56
TSC_G5_E3  (via drill 0.35)
  Top 0.2: R11.2 18.96,36.58 20.32,36.58 21.84,38.1 v21.84,38.61 | v44.32,15.75 42.93,15.75 42.31,16.36 U1.42
  Bottom 0.2: v21.84,38.61 30.99,38.61 44.2,25.4 44.2,15.75 v44.32,15.75
TSC_G5_SAMPLER
  Top 0.2: U1.43 41.81,20.93 40.89,21.84 39.88,21.84 38.86,22.86 38.86,23.71 C9.1
TSC_G6_E1  (via drill 0.35)
  Top 0.2: R12.2 21.84,40.3 v21.84,42.16 | v44.96,7.37 43.81,8.51 U1.22
  Bottom 0.152: 51.81,31.24 48.51,34.54 48.51,38.1 50.23,39.81 50.23,43.88
  Bottom 0.2: v21.84,42.16 24.89,45.21 48.89,45.21 50.23,43.88 | v44.96,7.37 45.21,7.37 48.01,10.16
  Bottom 0.203: 48.01,10.16 48.01,11.43 51.82,15.24 51.82,30.6 51.81,30.6 51.81,31.24
TSC_G6_E2  (via drill 0.35)
  Top 0.2: U1.25 42.2,10.89 v40.64,12.45 | v10.16,36.58 9.56,36.58 R18.2
  Bottom 0.2: v40.64,12.45 39.88,13.21 39.88,14.48 36.93,17.43 34.64,17.43 30.83,21.24 23.95,21.24 13.11,32.08 13.11,33.63 v10.16,36.58
TSC_G6_E3  (via drill 0.35)
  Top 0.2: U1.26 42.97,11.39 40.77,13.59 | v13.46,36.32 11.72,36.32 R19.2
  Top 0.203: v40.58,13.59 40.76,13.59 40.77,13.59
  Bottom 0.2: v40.58,13.59 40.58,14.29 37.08,17.78 34.92,17.78 31.11,21.59 24.1,21.59 13.46,32.23 v13.46,36.32
TSC_G6_SAMPLER  (via drill 0.35)
  Top 0.2: v34.8,13.84 34.54,14.1 33.66,14.1 31.92,15.83 31.92,17.44 30.82,18.54 C8.1 | v39.12,14.22 40.84,14.22 43.2,11.86 46.28,11.86 U1.27
  Bottom 0.2: v34.8,13.84 34.93,13.97 38.86,13.97 v39.12,14.22
VBAT  (via drill 0.35)
  Top 0.152: U2.3 25.47,11.75 | 25.29,13.44 U2.1
  Top 0.2: 23.35,10.02 23.23,10.02 | v24.89,14.73 24.89,13.83 U2.1
  Top 0.254: U2.3 26.23,11.75 26.42,11.94 26.42,13.21 25.97,13.65 U2.1
  Top 0.813: U$4.P1 23.96,5.39 C7.1 23.88,8.46 23.88,9.37 23.23,10.02 22.86,10.39 22.86,13.06 23.45,13.65 U2.1
  Bottom 0.2: VBAT_TP.TP v24.89,14.73

### Text on the board
tNames: TX | GND | VREF | DIO | CLK | NRST | GND | PROG | BOOT | 0 | SWCLK | BLE_UART | 1 | + | -
tValues: TX | GND | VREF | DIO | CLK | RST | GND | BOOT | 0 | PROG | CLK | BLE | 1 | + | -